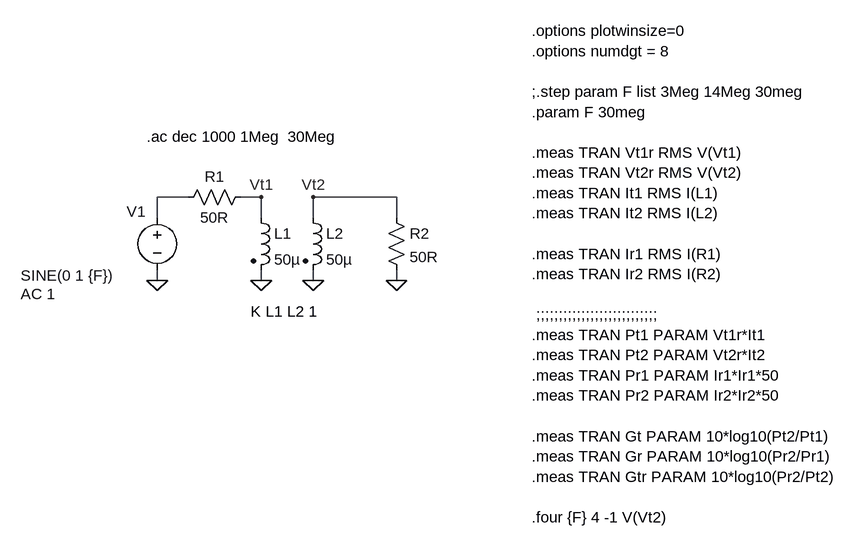
[diagram p0: schematic Transformer Power Transfer.asc]
Transformer Power Transfer.asc, the LTspice schematic file:
Version 4
SHEET 1 1260 1408
WIRE 48 80 0 80
WIRE 160 80 128 80
WIRE 368 80 240 80
WIRE 0 112 0 80
WIRE 160 112 160 80
WIRE 240 112 240 80
WIRE 368 112 368 80
WIRE 0 208 0 192
WIRE 160 208 160 192
WIRE 240 208 240 192
WIRE 368 208 368 192
FLAG 160 208 0
FLAG 240 208 0
FLAG 368 208 0
FLAG 0 208 0
FLAG 160 80 Vt1
FLAG 240 80 Vt2
SYMBOL ind2 144 96 R0
SYMATTR InstName L1
SYMATTR Value 50µ
SYMATTR Type ind
SYMBOL ind2 224 96 R0
SYMATTR InstName L2
SYMATTR Value 50µ
SYMATTR Type ind
SYMBOL res 352 96 R0
SYMATTR InstName R2
SYMATTR Value 50R
SYMBOL voltage 0 96 R0
WINDOW 0 -47 6 Left 2
WINDOW 3 -210 105 Left 2
WINDOW 123 -210 133 Left 2
WINDOW 39 0 0 Left 2
SYMATTR InstName V1
SYMATTR Value SINE(0 1 {F})
SYMATTR Value2 AC 1
SYMBOL res 144 64 R90
WINDOW 0 0 56 VBottom 2
WINDOW 3 32 56 VTop 2
SYMATTR InstName R1
SYMATTR Value 50R
TEXT 144 256 Left 2 !K L1 L2 1
TEXT -16 -13 Left 2 !.ac dec 1000 1Meg  30Meg
TEXT 576 -176 Left 2 !.options plotwinsize=0\n.options numdgt = 8\n \n;.step param F list 3Meg 14Meg 30meg\n.param F 30meg\n \n.meas TRAN Vt1r RMS V(Vt1)\n.meas TRAN Vt2r RMS V(Vt2)\n.meas TRAN It1 RMS I(L1)\n.meas TRAN It2 RMS I(L2)\n \n.meas TRAN Ir1 RMS I(R1)\n.meas TRAN Ir2 RMS I(R2)\n \n ;;;;;;;;;;;;;;;;;;;;;;;;;;;\n.meas TRAN Pt1 PARAM Vt1r*It1\n.meas TRAN Pt2 PARAM Vt2r*It2\n.meas TRAN Pr1 PARAM Ir1*Ir1*50\n.meas TRAN Pr2 PARAM Ir2*Ir2*50\n \n.meas TRAN Gt PARAM 10*log10(Pt2/Pt1)\n.meas TRAN Gr PARAM 10*log10(Pr2/Pr1)\n.meas TRAN Gtr PARAM 10*log10(Pr2/Pt2)\n \n.four {F} 4 -1 V(Vt2)

The netlist it stands for:
* Transformer Power Transfer.asc
L1 Vt1 0 50µ
L2 Vt2 0 50µ
R2 Vt2 0 50R
V1 N001 0 SINE(0 1 {F}) AC 1
R1 Vt1 N001 50R
K L1 L2 1
.ac dec 1000 1Meg  30Meg
.options plotwinsize=0
.options numdgt = 8
;.step param F list 3Meg 14Meg 30meg
.param F 30meg
.meas TRAN Vt1r RMS V(Vt1)
.meas TRAN Vt2r RMS V(Vt2)
.meas TRAN It1 RMS I(L1)
.meas TRAN It2 RMS I(L2)
.meas TRAN Ir1 RMS I(R1)
.meas TRAN Ir2 RMS I(R2)
 ;;;;;;;;;;;;;;;;;;;;;;;;;;;
.meas TRAN Pt1 PARAM Vt1r*It1
.meas TRAN Pt2 PARAM Vt2r*It2
.meas TRAN Pr1 PARAM Ir1*Ir1*50
.meas TRAN Pr2 PARAM Ir2*Ir2*50
.meas TRAN Gt PARAM 10*log10(Pt2/Pt1)
.meas TRAN Gr PARAM 10*log10(Pr2/Pr1)
.meas TRAN Gtr PARAM 10*log10(Pr2/Pt2)
.four {F} 4 -1 V(Vt2)
.backanno
.end